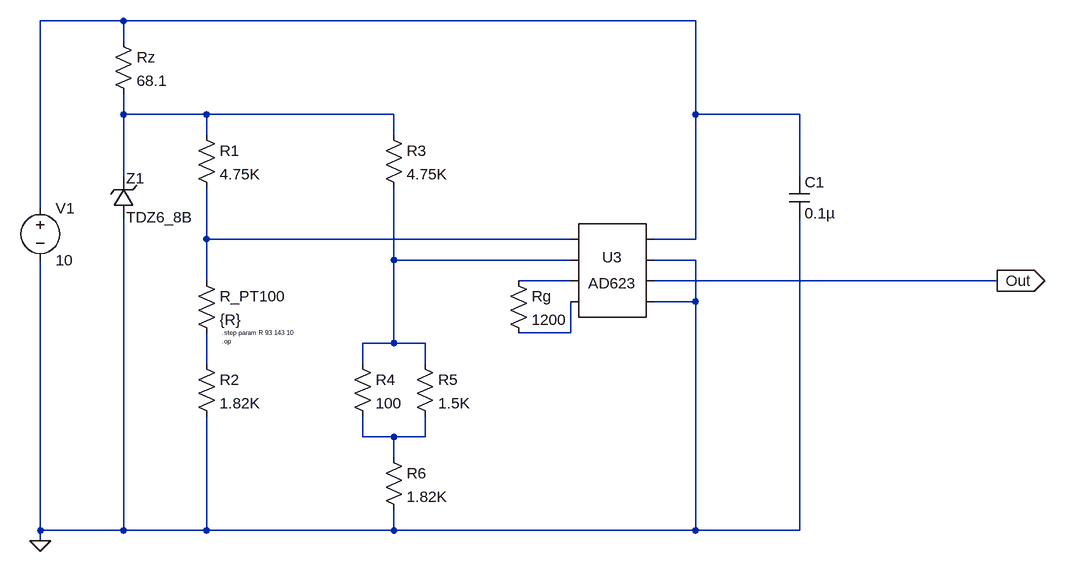
[diagram p0: schematic Temperature_Measurement.asc]
Temperature_Measurement.asc, the LTspice schematic file:
Version 4
SHEET 1 1752 760
WIRE 64 -80 -64 -80
WIRE 944 -80 64 -80
WIRE 64 -48 64 -80
WIRE 64 64 64 32
WIRE 192 64 64 64
WIRE 480 64 192 64
WIRE 944 64 944 -80
WIRE 1104 64 944 64
WIRE 192 96 192 64
WIRE 480 96 480 64
WIRE 64 160 64 64
WIRE 1104 160 1104 64
WIRE -64 208 -64 -80
WIRE 192 256 192 176
WIRE 752 256 192 256
WIRE 944 256 944 64
WIRE 944 256 880 256
WIRE 480 288 480 176
WIRE 752 288 480 288
WIRE 944 288 880 288
WIRE 192 320 192 256
WIRE 752 320 672 320
WIRE 1408 320 880 320
WIRE 944 352 944 288
WIRE 944 352 880 352
WIRE 752 400 752 352
WIRE 752 400 672 400
WIRE 480 416 480 288
WIRE 480 416 432 416
WIRE 528 416 480 416
WIRE 192 448 192 400
WIRE 432 448 432 416
WIRE 528 448 528 416
WIRE 432 560 432 528
WIRE 480 560 432 560
WIRE 528 560 528 528
WIRE 528 560 480 560
WIRE 480 592 480 560
WIRE -64 704 -64 288
WIRE 64 704 64 224
WIRE 64 704 -64 704
WIRE 192 704 192 528
WIRE 192 704 64 704
WIRE 480 704 480 672
WIRE 480 704 192 704
WIRE 944 704 944 352
WIRE 944 704 480 704
WIRE 1104 704 1104 224
WIRE 1104 704 944 704
WIRE -64 720 -64 704
FLAG -64 720 0
FLAG 1408 320 Out
IOPIN 1408 320 Out
SYMBOL res 176 80 R0
SYMATTR InstName R1
SYMATTR Value 4.75K
SYMATTR SpiceLine tol=1 pwr=0.1
SYMBOL res 176 432 R0
SYMATTR InstName R2
SYMATTR Value 1.82K
SYMATTR SpiceLine tol=1 pwr=0.1
SYMBOL res 464 80 R0
SYMATTR InstName R3
SYMATTR Value 4.75K
SYMATTR SpiceLine tol=1 pwr=0.1
SYMBOL res 416 432 R0
SYMATTR InstName R4
SYMATTR Value 100
SYMATTR SpiceLine tol=1 pwr=0.1
SYMBOL res 512 432 R0
SYMATTR InstName R5
SYMATTR Value 1.5K
SYMATTR SpiceLine tol=1 pwr=0.1
SYMBOL res 464 576 R0
SYMATTR InstName R6
SYMATTR Value 1.82K
SYMATTR SpiceLine tol=1 pwr=0.1
SYMBOL res 48 -64 R0
SYMATTR InstName Rz
SYMATTR Value 68.1
SYMATTR SpiceLine tol=1 pwr=0.1
SYMBOL res 656 304 R0
SYMATTR InstName Rg
SYMATTR Value 1200
SYMBOL zener 80 224 R180
WINDOW 0 -17 62 Left 2
WINDOW 3 -92 2 Left 2
SYMATTR InstName Z1
SYMATTR Value TDZ6_8B
SYMBOL cap 1088 160 R0
SYMATTR InstName C1
SYMATTR Value 0.1µ
SYMATTR SpiceLine V=10 Irms=1.02 Rser=0.0850352 Lser=0 mfg="KEMET" pn="C1206F104K8RAC" type="X7R"
SYMBOL res 176 304 R0
SYMATTR InstName R_PT100
SYMATTR Value {R}
SYMBOL voltage -64 192 R0
WINDOW 123 0 0 Left 0
WINDOW 39 0 0 Left 0
SYMATTR InstName V1
SYMATTR Value 10
SYMBOL AutoGenerated\\AD623 816 304 R0
SYMATTR InstName U3
TEXT 216 400 Left 0 !.step param R 93 143 10\n.op

The netlist it stands for:
* Temperature_Measurement.asc
R1 N002 N003 4.75K tol=1 pwr=0.1
R2 N007 0 1.82K tol=1 pwr=0.1
R3 N002 N004 4.75K tol=1 pwr=0.1
R4 N004 N008 100 tol=1 pwr=0.1
R5 N004 N008 1.5K tol=1 pwr=0.1
R6 N008 0 1.82K tol=1 pwr=0.1
Rz N001 N002 68.1 tol=1 pwr=0.1
Rg N005 N006 1200
D§Z1 0 N002 TDZ6_8B
C1 N001 0 0.1µ V=10 Irms=1.02 Rser=0.0850352 Lser=0 mfg="KEMET" pn="C1206F104K8RAC" type="X7R"
R_PT100 N003 N007 {R}
V1 N001 0 10
* U3: AD623 (symbol AutoGenerated\AD623 not available, pins judged from their places): pin1=N003 pin2=N004 pin3=N005 pin4=N006 pin5=N001 pin6=0 pin7=Out pin8=0
.model D D
.lib standard.dio
.step param R 93 143 10
.op
.backanno
.end